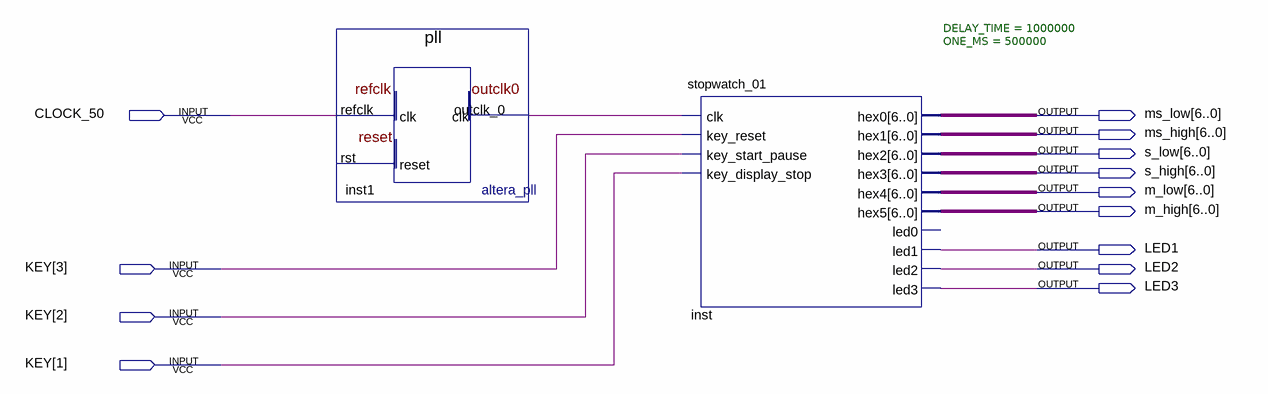
[diagram p0: schematic sheet]
// Quartus schematic stopwatch.bdf as structural Verilog: 2 symbols, 13 pins
module stopwatch (
  input  CLOCK_50,
  input  [3:1] KEY,
  output [6:0] ms_low,
  output [6:0] ms_high,
  output [6:0] s_low,
  output [6:0] s_high,
  output [6:0] m_low,
  output [6:0] m_high,
  output LED1,
  output LED2,
  output LED3
);

  wire inst1_outclk_0;

  pll inst1 (.refclk(CLOCK_50), .outclk_0(inst1_outclk_0));  // open: rst
  stopwatch_01 #(.DELAY_TIME(1000000), .ONE_MS(500000)) inst (
    .clk(inst1_outclk_0), .key_reset(KEY[3]), .key_start_pause(KEY[2]), .key_display_stop(KEY[1]),
    .hex0(ms_low), .hex1(ms_high), .hex2(s_low), .hex3(s_high), .hex4(m_low), .hex5(m_high), .led1(LED1),
    .led2(LED2), .led3(LED3));  // open: led0
endmodule
